# EAGLE schematic royer_DBD (EAGLE 7.2.0)
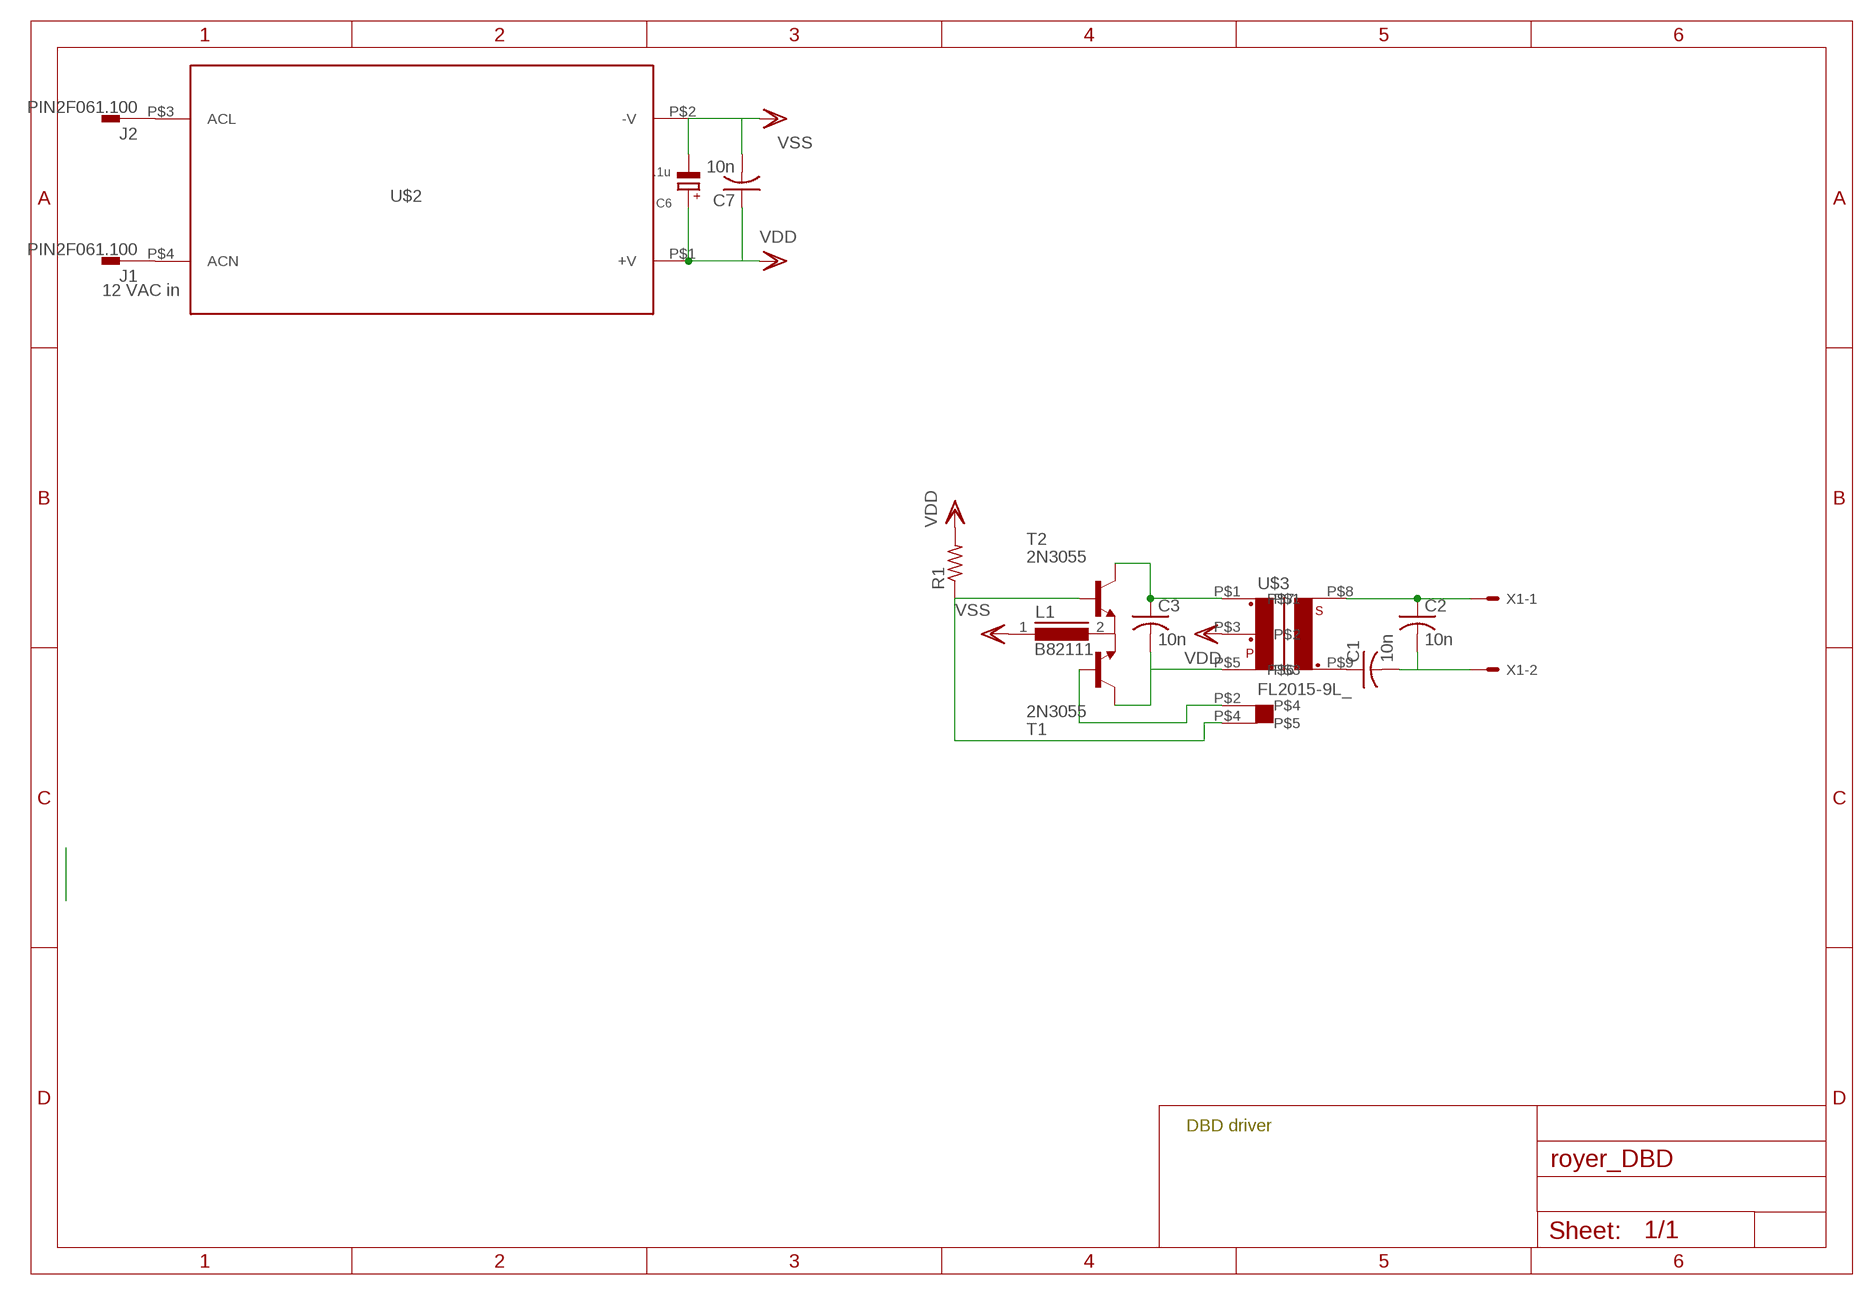
[diagram p0: schematic, sheet 1]

## Parts
C1  10n  C-US075-042X103  [C075-042X103]
C2  10n  C-US075-042X103  [C075-042X103]
C3  10n  C-US075-042X103  [C075-042X103]
C6  .1u  CPOL-EUE5-8.5  [E5-8,5]
C7  10n  C-US075-042X103  [C075-042X103]
J1  PIN2F061.100  [F061.100]
J2  PIN2F061.100  [F061.100]
L1  B82111  [SUKW1-30]
R1  R-US_0207/10  [0207/10]
T1  2N3055  [TO3]
T2  2N3055  [TO3]
U$2  IRM-60-12  [IRM-60-12]
U$3  FL2015-9L_  [1]
X1  KK-156-2  [KK-156-2]

## Nets
N$1: R1.1 T2.B U$3.P$4
N$2: L1.2 T1.E T2.E
N$3: C3.1 T2.C T2.C/(C) U$3.P$1
N$4: C3.2 T1.C T1.C/(C) U$3.P$5
N$5: T1.B U$3.P$2
N$6: J1.A1 J1.A2 U$2.P$4(ACN)
N$8: J2.A1 J2.A2 U$2.P$3(ACL)
N$9: C1.1 U$3.P$9
N$10: C2.1 U$3.P$8 X1.1
N$11: C1.2 C2.2 X1.2
VDD: C6.+ C7.1 R1.2 U$2.P$1(+V) U$3.P$3
VSS: C6.- C7.2 L1.1 U$2.P$2(-V)

## Notes on the sheet
- 12 VAC in
- DBD driver

## Library data of the parts
C1-C3 C7 = rcl:C-US: CAPACITOR, American symbol
C6 = rcl:CPOL-EU: POLARIZED CAPACITOR, European symbol
J1 J2 = con-faston:PIN2: Flachstecker Typ Tyco/Electronics/AMP TAB, FASTON Printed Circuit Board Tabs Source: http://www.buerklin.com, http://catalog.tycoelectronics.com; OC_FARNELL: unknown; OC_NEWARK: unknown
L1 = inductors:B82111: INDUCTOR
R1 = resistor:R-US_: RESISTOR, American symbol
T1 T2 = transistor:2N3055: NPN TRANSISTOR
U$2 = meanwell:IRM-60-12
U$3 = trafo:FL2015-9L_
X1 = con-molex:KK-156-2: KK 156 HEADER Source: http://www.molex.com/pdm_docs/sd/026604100_sd.pdf; OC_FARNELL: unknown; OC_NEWARK: unknown